# Altium schematic sheet Air_quality.SchDoc: Air_quality
size Letter; DrawnBy: D. Fusi; DocumentNumber: 4; Revision: PVT; SheetNumber: 4; SheetTotal: 7
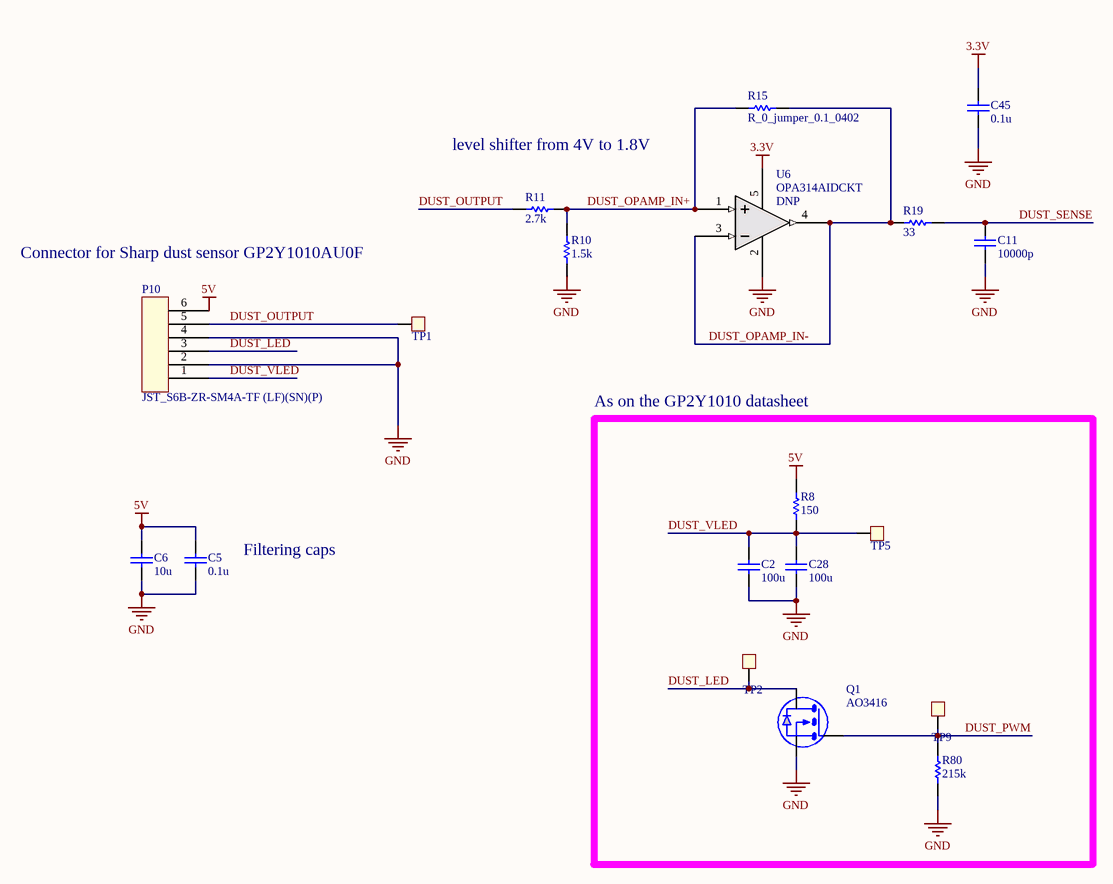
[diagram p0: Air_quality.SchDoc]

## Parts
C2  100u  [CAP1206_SENSE_DVT]
C5  0.1u  [CAP0603_SENSE_DVT]
C6  10u  [CAP0603_SENSE_DVT]
C11  10000p  [CAP0402_SENSE_DVT]
C28  100u  [CAP1206_SENSE_DVT]
C45  0.1u  [CAP0402_SENSE_DVT]
P10  JST_S6B-ZR-SM4A-TF (LF)(SN)(P)  [JST_S6B-ZR-SM4A-TF (LF)(SN)(P)]
Q1  AO3416  [SOT-23]
R8  150  [RES0805_SENSE_DVT]
R10  1.5k  [RES0603_SENSE_DVT]
R11  2.7k  [RES0402_SENSE_DVT]
R15  R_0_jumper_0.1_0402  [RES0402-SENSE-DVT]
R19  33  [RES0402_SENSE_DVT]
R80  215k  [RES0402_SENSE_DVT]
TP1  TP  [TP-1.1]  (value not drawn)
TP2  TP  [TP-1.1]  (value not drawn)
TP5  TP  [TP-1.1]  (value not drawn)
TP9  TP  [TP-1.1]  (value not drawn)
U6  DNP  [SC-70-5]

## Blocks framed on the sheet
As on the GP2Y1010 datasheet: C2 C28 Q1 R8 R80 TP2 TP5 TP9

## Nets
3.3V: C45.2 U6.5(V+)
5V: C5.2 C6.2 P10.6 R8.2
GND: C2.1 C5.1 C6.1 C11.1 C28.1 C45.1 P10.2 P10.4 Q1.2(S) R10.2 R80.1 U6.2(V-)
DUST_LED: P10.3 Q1.3(D) TP2.1
DUST_OPAMP_IN+: R10.1 R11.2 R15.1 U6.1(IN+)
DUST_OPAMP_IN-: R15.2 R19.1 U6.3(IN-) U6.4(OUT)
DUST_OUTPUT: P10.5 R11.1 TP1.1
DUST_PWM: Q1.1(G) R80.2 TP9.1
DUST_SENSE: C11.2 R19.2
DUST_VLED: C2.2 C28.2 P10.1 R8.1 TP5.1

## Notes on the sheet
- level shifter from 4V to 1.8V
- Connector for Sharp dust sensor GP2Y1010AU0F
- (near C5) Filtering caps
- TITLE
- DATE
- DRAWN BY
- REV
- SHEET
- OF

## Library data of the parts
C2 C28 = C_100u_20_10_X5R_1206: Chip capacitor; Vendor: TDK; PN: C3216X5R1A107M160AC; Tolerance: 20%; Voltage: 10V; Temp: X5R; Hello_PN: 225-00304; Value: 100u; Size: 1206; item_category: Capacitor
C5 = C_0.1u_20_16_X7R_0603: Chip capacitor; Vendor: Samsung; PN: CL10B104MO8NNNC; Tolerance: 20%; Voltage: 16V; Temp: X7R; Hello_PN: 225-00235; Value: 0.1u; Size: 0603
C6 = C_10u_10_6.3_X5R_0603: Chip capacitor; Vendor: TDK; PN: C1608X5R0J106K080AB; Tolerance: 10%; Voltage: 6.3V; Temp: X5R; Hello_PN: 225-00415; Value: 10u; Size: 0603; item_category: Capacitor
C11 = C_10000p_10_50_X7R_0402: Chip capacitor; Vendor: Taiyo Yuden; PN: UMK105B7103KV-F; Tolerance: 10%; Voltage: 50V; Temp: X7R; Hello_PN: 225-00349; Value: 10000p; Size: 0402; item_category: Capacitor
C45 = C_0.1u_10_50_X7R_0402: Chip capacitor; Vendor: Taiyo Yuden; PN: UMK105B7104KV-FR; Tolerance: 10%; Voltage: 50V; Temp: X7R; Hello_PN: 225-00468; Value: 0.1u; Size: 0402; item_category: Capacitor
P10 = JST_S6B-ZR-SM4A-TF (LF)(SN)(P): 6-pin JST connector; Hello_PN: 280-00256; PN: JST_S6B-ZR-SM4A-TF (LF)(SN)(P); Vendor: JST; item_category: Connector
Q1 = AO3416: N-channel enhancement mode FET; Vendor: Alpha and Omega; Hello_PN: 240-00234; item_category: Transistor; PN: AO3416
R8 = R_150_5_0.125_0805: Chip Resistor; Vendor: Panasonic; Tolerance: 5 %; Power: 0.125 W; PN: ERJ-6GEYJ151V; Hello_PN: 220-00406; Model: *; Value: 150; Size: 0805; item_category: Resistor
R10 = R_1.5k_1_0.1_0603: Chip Resistor; Vendor: Panasonic; Tolerance: 1 %; Power: 0.1 W; PN: ERJ-3EKF1501V; Hello_PN: 220-00407; Model: *; Value: 1.5k; Size: 0603; item_category: Resistor
R11 = R_2.7k_1_0.1_0402: RES SMD 2.7K OHM 1% 1/16W 0402; Vendor: Yageo; PN: RC0402JR-072K7L; Hello_PN: 220-00446; Model: *; Value: 2.7k; Tolerance: 1 %; Power: 1/16W; Size: 0402
R15 = R_0_jumper_0.1_0402: Chip Resistor; Value: 0; Vendor: Panasonic; Tolerance: Jumper; Power: 0.1 W; PN: ERJ-2GE0R00X; Hello_PN: 220-00408; Model: *; Size: 0402; item_category: Resistor
R19 = R_33_5_0.1_0402: Chip Resistor; Vendor: Panasonic; Tolerance: 5 %; Power: 0.1 W; PN: ERJ-2GEJ330X; Hello_PN: 220-00411; Model: *; Value: 33; Size: 0402; item_category: Resistor
R80 = R_215k_1_0.1_0402: Chip Resistor; Vendor: Panasonic; Tolerance: 1 %; Power: 0.1 W; PN: ERJ-2RKF2153X; Hello_PN: 220-00301; Model: *; Value: 215k; Size: 0402; item_category: Resistor
TP1 TP2 TP5 TP9 = TP: testpoint
U6 = OPA314AIDCKT: TI single 1.8-5.5V OPAMP; PN: OPA314AIDCKT; Vendor: TI